# EAGLE design RobotBoard_withMCPower (EAGLE 6.1)
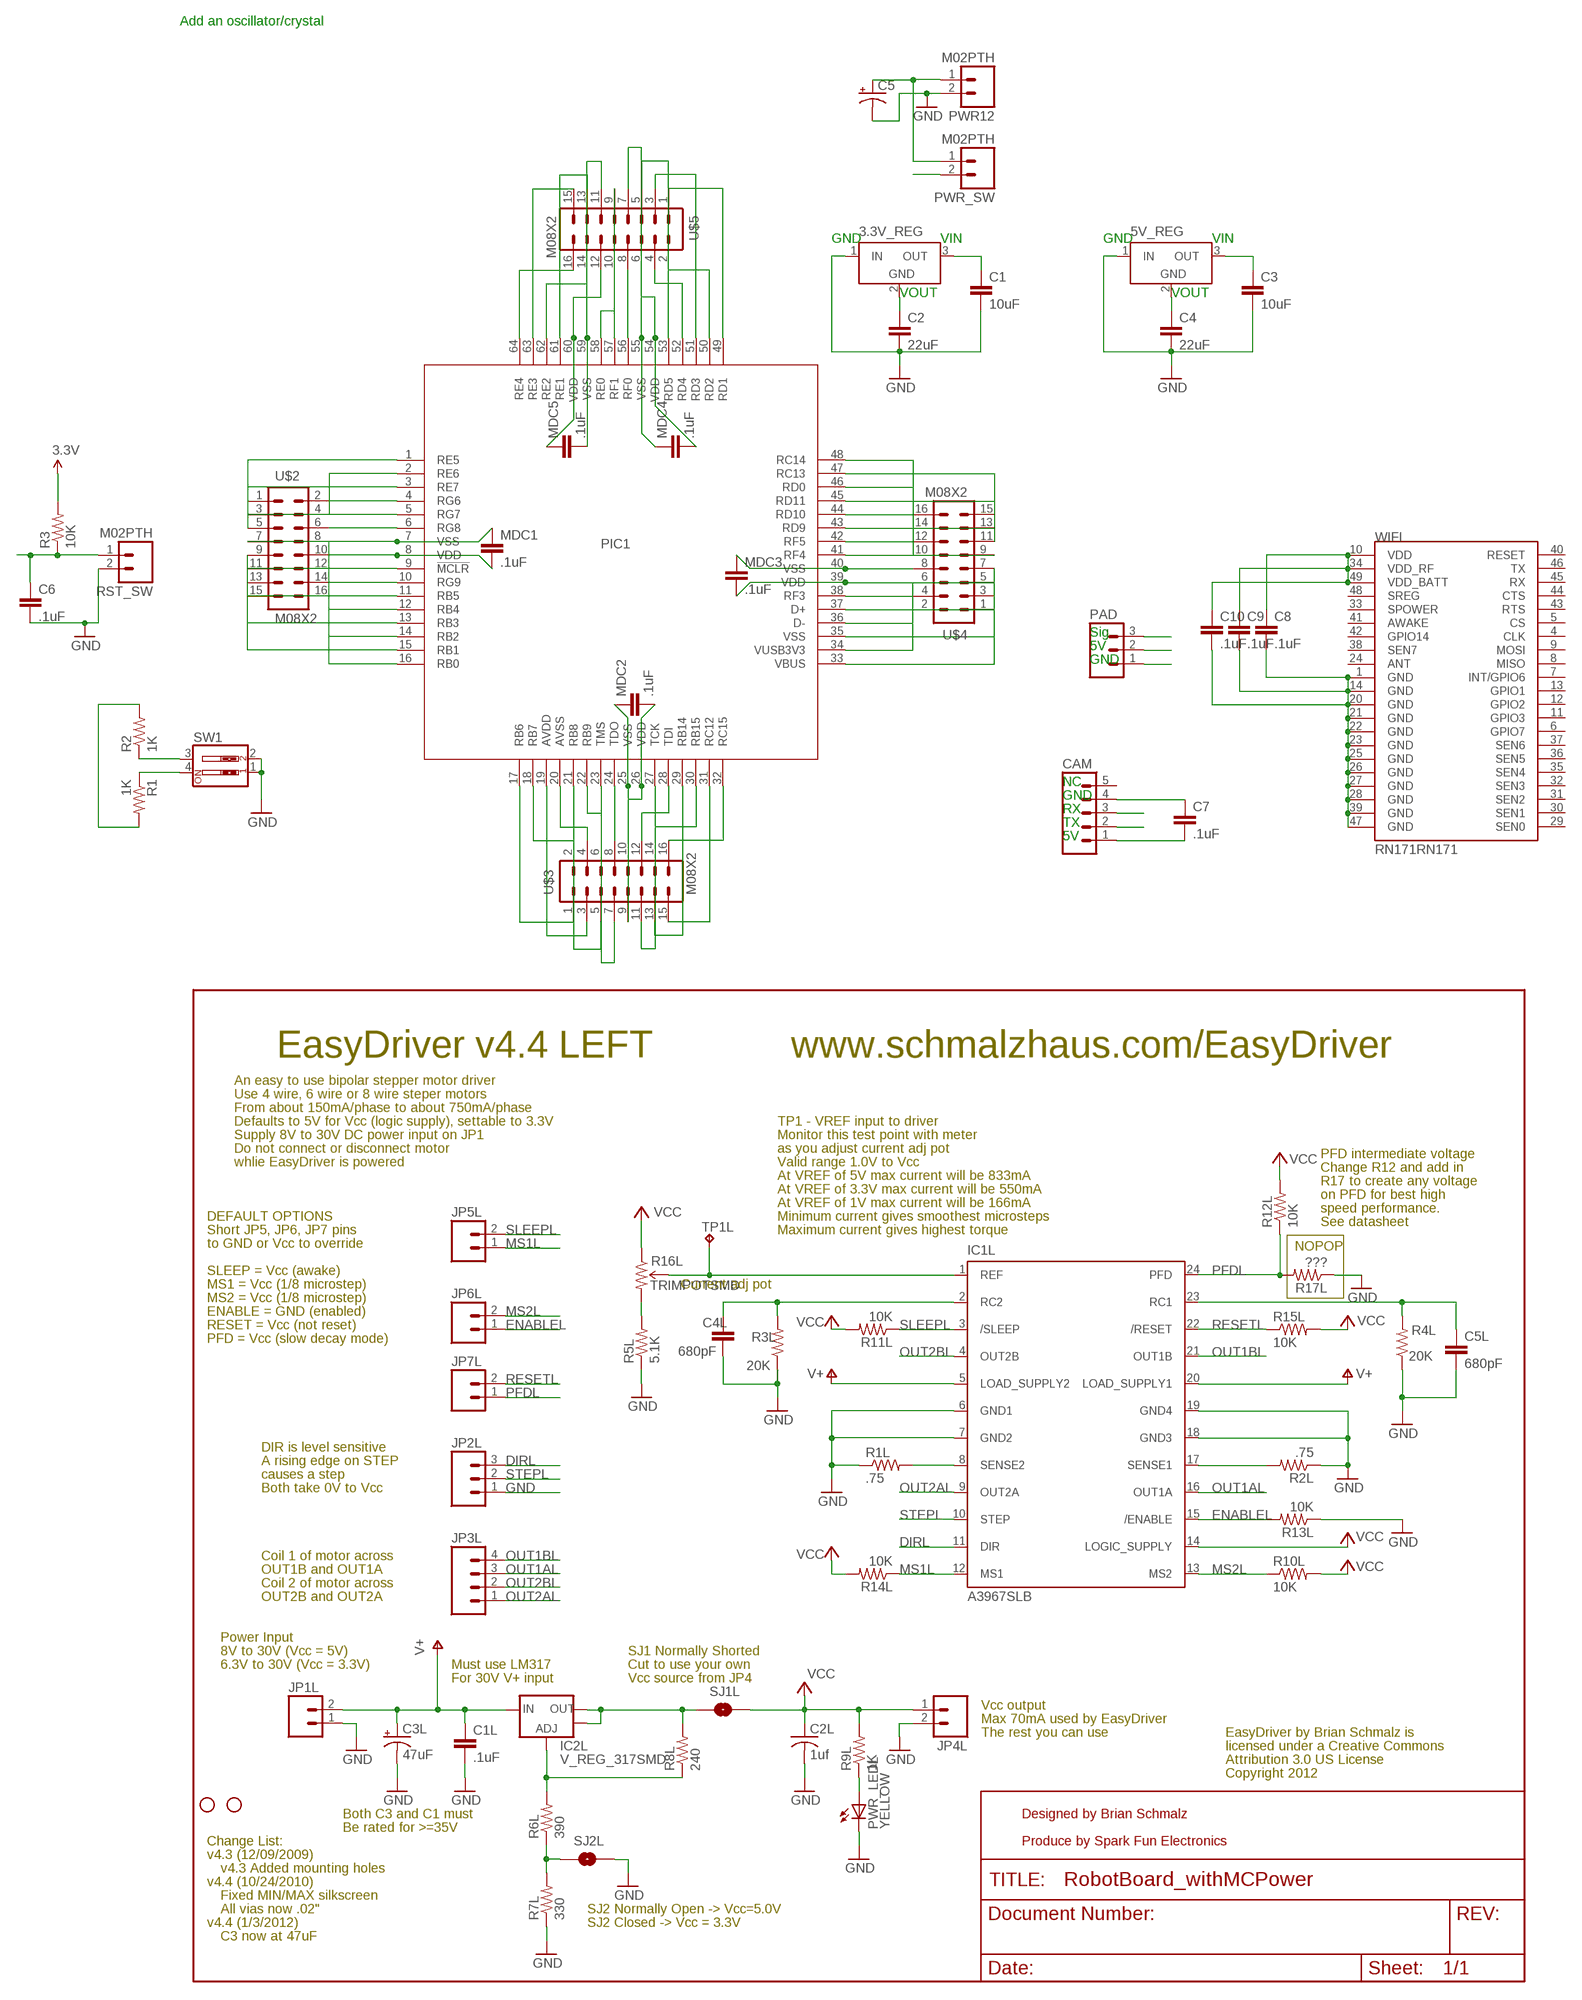
[diagram p0: schematic, sheet 1, part 1 of 2]
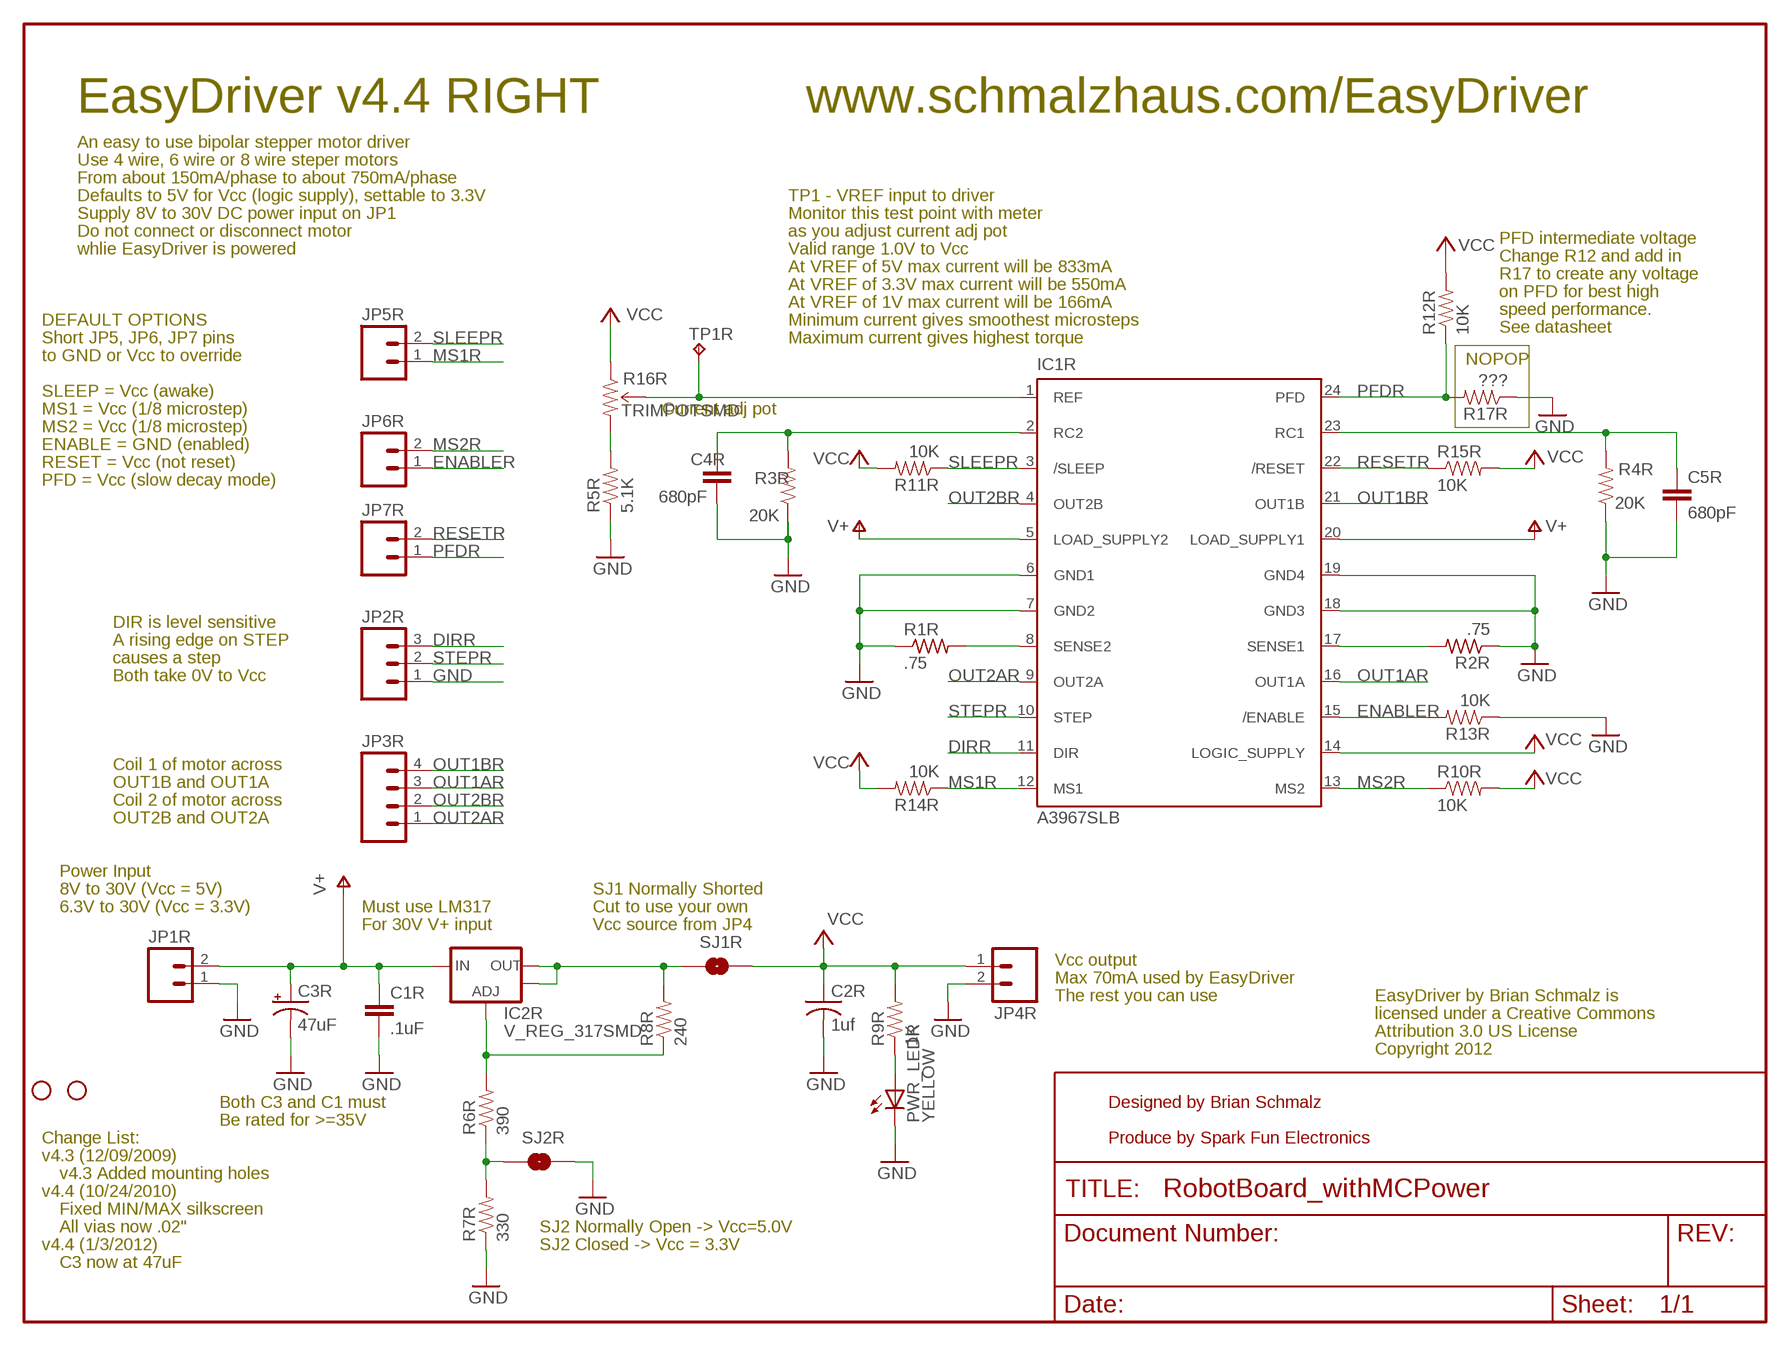
[diagram p1: schematic, sheet 1, part 2 of 2]

## Parts
3.3V_REG  LT1129CST5  [SOT223]
5V_REG  LT1129CST5  [SOT223]
C1  10uF  CAP0603  [0603]
C1L  .1uF  CAP0603  [0603]
C1R  .1uF  CAP0603  [0603]
C2  22uF  CAP0603  [0603]
C2L  1uf  C-USC0603  [C0603]
C2R  1uf  C-USC0603  [C0603]
C3  10uF  CAP0603  [0603]
C3L  47uF  CPOL-USD  [PANASONIC_D]
C3R  47uF  CPOL-USD  [PANASONIC_D]
C4  22uF  CAP0603  [0603]
C4L  680pF  CAP0402  [C0402]
C4R  680pF  CAP0402  [C0402]
C5  CAP_POLPTH4  [CPOL-RADIAL-1000UF-25V]
C5L  680pF  CAP0402  [C0402]
C5R  680pF  CAP0402  [C0402]
C6  .1uF  CAP0603  [0603]
C7  .1uF  CAP0603  [0603]
C8  .1uF  CAP0603  [0603]
C9  .1uF  CAP0603  [0603]
C10  .1uF  CAP0603  [0603]
CAM  M05LOCK  [1X05_LOCK]
IC1L  A3967SLB  [SO24W]
IC1R  A3967SLB  [SO24W]
IC2L  V_REG_317SMD  [SOT223]
IC2R  V_REG_317SMD  [SOT223]
JP1  STAND-OFF  [STAND-OFF]
JP1L  M021X02_NO_SILK  [1X02_NO_SILK]
JP1R  M021X02_NO_SILK  [1X02_NO_SILK]
JP2  STAND-OFF  [STAND-OFF]
JP2L  M031X03_NO_SILK  [1X03_NO_SILK]
JP2R  M031X03_NO_SILK  [1X03_NO_SILK]
JP3L  M041X04_NO_SILK  [1X04_NO_SILK]
JP3R  M041X04_NO_SILK  [1X04_NO_SILK]
JP4L  M021X02_NO_SILK  [1X02_NO_SILK]
JP4R  M021X02_NO_SILK  [1X02_NO_SILK]
JP5L  M021X02_NO_SILK  [1X02_NO_SILK]
JP5R  M021X02_NO_SILK  [1X02_NO_SILK]
JP6L  M021X02_NO_SILK  [1X02_NO_SILK]
JP6R  M021X02_NO_SILK  [1X02_NO_SILK]
JP7L  M021X02_NO_SILK  [1X02_NO_SILK]
JP7R  M021X02_NO_SILK  [1X02_NO_SILK]
JP8  STAND-OFF  [STAND-OFF]
JP9  STAND-OFF  [STAND-OFF]
MDC1  .1uF  CAP0603  [0603]
MDC2  .1uF  CAP0603  [0603]
MDC3  .1uF  CAP0603  [0603]
MDC4  .1uF  CAP0603  [0603]
MDC5  .1uF  CAP0603  [0603]
PAD  M03POLAR  [MOLEX-1X3]
PIC1  PIC32MZ2048ECM064  [TQFP64-10X10X1MM]
PWR12  M02PTH  [1X02]
PWR_LEDL  YELLOW  LED0603  [LED-0603]
PWR_LEDR  YELLOW  LED0603  [LED-0603]
PWR_SW  M02PTH  [1X02]
R1  1K  RESISTOR0402  [C0402]
R1L  .75  R-US_R0805  [R0805]
R1R  .75  R-US_R0805  [R0805]
R2  1K  RESISTOR0402  [C0402]
R2L  .75  R-US_R0805  [R0805]
R2R  .75  R-US_R0805  [R0805]
R3  10K  RESISTOR0402  [C0402]
R3L  20K  RESISTOR0402  [C0402]
R3R  20K  RESISTOR0402  [C0402]
R4L  20K  RESISTOR0402  [C0402]
R4R  20K  RESISTOR0402  [C0402]
R5L  5.1K  RESISTOR0402  [C0402]
R5R  5.1K  RESISTOR0402  [C0402]
R6L  390  RESISTOR0402  [C0402]
R6R  390  RESISTOR0402  [C0402]
R7L  330  RESISTOR0402  [C0402]
R7R  330  RESISTOR0402  [C0402]
R8L  240  RESISTOR0402  [C0402]
R8R  240  RESISTOR0402  [C0402]
R9L  1K  RESISTOR0402  [C0402]
R9R  1K  RESISTOR0402  [C0402]
R10L  10K  RESISTOR0402  [C0402]
R10R  10K  RESISTOR0402  [C0402]
R11L  10K  RESISTOR0402  [C0402]
R11R  10K  RESISTOR0402  [C0402]
R12L  10K  RESISTOR0402  [C0402]
R12R  10K  RESISTOR0402  [C0402]
R13L  10K  RESISTOR0402  [C0402]
R13R  10K  RESISTOR0402  [C0402]
R14L  10K  RESISTOR0402  [C0402]
R14R  10K  RESISTOR0402  [C0402]
R15L  10K  RESISTOR0402  [C0402]
R15R  10K  RESISTOR0402  [C0402]
R16L  TRIMPOTSMD  [TRIMPOT-3MM]
R16R  TRIMPOTSMD  [TRIMPOT-3MM]
R17L  ???  RESISTOR0402  [C0402]
R17R  ???  RESISTOR0402  [C0402]
RST_SW  M02PTH  [1X02]
SJ1L  SOLDERJUMPERTRACE  [SJ_2S-TRACE]
SJ1R  SOLDERJUMPERTRACE  [SJ_2S-TRACE]
SJ2L  SOLDERJUMPERNO  [SJ_2S-NO]
SJ2R  SOLDERJUMPERNO  [SJ_2S-NO]
SW1  SW_DIP-2  [DIPSWITCH-02]
TP1L  TPPAD1-13  [P1-13]
TP1R  TPPAD1-13  [P1-13]
U$2  M08X2  [2X8]
U$3  M08X2  [2X8]
U$4  M08X2  [2X8]
U$5  M08X2  [2X8]
WIFI  RN171RN171  [RN171]

## Nets
5V: 5V_REG.2(GND) C4.1 C7.2 CAM.1 PAD.2 R16L.1(CCW) ; supply symbol labelled VCC
5V_ALT1R: IC2R.2(OUT) IC2R.4(OUT) R8R.2 SJ1R.1
5V_ALTL: IC2L.2(OUT) IC2L.4(OUT) R8L.2 SJ1L.1
!MCLR: C6.1 PIC1.9(!MCLR) R3.1 RST_SW.1 U$2.9
AVDD: PIC1.19(AVDD) U$3.3
AVSS: PIC1.20(AVSS) U$3.4
CAM_RX: CAM.3
CAM_TX: CAM.2
D+: PIC1.37(D+) U$4.5
D-: PIC1.36(D-) U$4.4
DIRL: IC1L.11(DIR) JP2L.3
DIRR: IC1R.11(DIR) JP2R.3
ENABLEL: IC1L.15(/ENABLE) JP6L.1 R13L.2
ENABLER: IC1R.15(/ENABLE) JP6R.1 R13R.2
GND: 3.3V_REG.1(IN) 5V_REG.1(IN) C1.2 C1L.2 C1R.2 C2.2 C2L.2 C2R.2 C3.2 C3L.- C3R.- C4.2 C4L.2 C4R.2 C5.2(-) C5L.2 C5R.2 C6.2 C7.1 C8.2 C9.2 C10.2 CAM.4 IC1L.6(GND1) IC1L.7(GND2) IC1L.18(GND3) IC1L.19(GND4) IC1R.6(GND1) IC1R.7(GND2) IC1R.18(GND3) IC1R.19(GND4) JP1L.1 JP1R.1 JP2L.1 JP2R.1 JP4L.2 JP4R.2 MDC1.1 MDC2.1 MDC3.1 MDC4.1 MDC5.2 PAD.1 PIC1.7(VSS) PIC1.25(VSS) PIC1.35(VSS) PIC1.40(VSS) PIC1.55(VSS) PIC1.59(VSS) PWR12.2 PWR_LEDL.C PWR_LEDR.C R1L.1 R1R.1 R2L.1 R2R.1 R3L.1 R3R.1 R4L.1 R4R.1 R5L.1 R5R.1 R7L.1 R7R.1 R13L.1 R13R.1 R17L.1 R17R.1 RST_SW.2 SJ2L.2 SJ2R.2 SW1.1 SW1.2 U$2.7 U$3.9 U$4.3 U$4.8 U$5.7 U$5.11 WIFI.1(GND) WIFI.14(GND) WIFI.20(GND) WIFI.21(GND) WIFI.22(GND) WIFI.23(GND) WIFI.25(GND) WIFI.26(GND) WIFI.27(GND) WIFI.28(GND) WIFI.39(GND) WIFI.47(GND)
MS1L: IC1L.12(MS1) JP5L.1 R14L.1
MS1R: IC1R.12(MS1) JP5R.1 R14R.1
MS2L: IC1L.13(MS2) JP6L.2 R10L.1
MS2R: IC1R.13(MS2) JP6R.2 R10R.1
N$1: IC1L.8(SENSE2) R1L.2
N$2: PWR_LEDL.A R9L.1
N$3: IC1L.17(SENSE1) R2L.2
N$4: R6L.1 R7L.2 SJ2L.1
N$5: C4L.1 IC1L.2(RC2) R3L.2
N$6: IC2L.1(ADJ) R6L.2 R8L.1
N$7: C5L.1 IC1L.23(RC1) R4L.2
N$8: IC1R.8(SENSE2) R1R.2
N$9: IC1R.17(SENSE1) R2R.2
N$10: C4R.1 IC1R.2(RC2) R3R.2
N$11: R5L.2 R16L.3(CW)
N$12: IC1L.1(REF) R16L.2(WIPER) TP1L.1(TP)
N$13: C5R.1 IC1R.23(RC1) R4R.2
N$14: IC1R.1(REF) R16R.2(WIPER) TP1R.1(TP)
N$15: IC2R.1(ADJ) R6R.2 R8R.1
N$16: R5R.2 R16R.3(CW)
N$17: PWR_LEDR.A R9R.1
N$18: R6R.1 R7R.2 SJ2R.1
N$19: C5.1(+) PWR12.1 PWR_SW.1
N$20: 3.3V_REG.3(OUT) 5V_REG.3(OUT) C1.1 C3.1 PWR_SW.2
N$28: R1.1 SW1.4
N$29: R2.1 SW1.3
N$32: 3.3V_REG.2(GND) C2.1 C8.1 C9.1 C10.1 MDC1.2 MDC2.2 MDC3.2 MDC4.2 MDC5.1 PIC1.8(VDD) PIC1.26(VDD) PIC1.39(VDD) PIC1.54(VDD) PIC1.60(VDD) R1.2 R2.2 R3.2 U$2.8 U$3.10 U$4.7 U$5.6 U$5.12 WIFI.10(VDD) WIFI.34(VDD_RF) WIFI.49(VDD_BATT) ; supply symbol labelled 3.3V
OUT1AL: IC1L.16(OUT1A) JP3L.3
OUT1AR: IC1R.16(OUT1A) JP3R.3
OUT1BL: IC1L.21(OUT1B) JP3L.4
OUT1BR: IC1R.21(OUT1B) JP3R.4
OUT2AL: IC1L.9(OUT2A) JP3L.1
OUT2AR: IC1R.9(OUT2A) JP3R.1
OUT2BL: IC1L.4(OUT2B) JP3L.2
OUT2BR: IC1R.4(OUT2B) JP3R.2
PAD_SIG: PAD.3
PFDL: IC1L.24(PFD) JP7L.1 R12L.1 R17L.2
PFDR: IC1R.24(PFD) JP7R.1 R12R.1 R17R.2
RB0: PIC1.16(RB0) U$2.16
RB1: PIC1.15(RB1) U$2.15
RB2: PIC1.14(RB2) U$2.14
RB3: PIC1.13(RB3) U$2.13
RB4: PIC1.12(RB4) U$2.12
RB5: PIC1.11(RB5) U$2.11
RB6: PIC1.17(RB6) U$3.1
RB7: PIC1.18(RB7) U$3.2
RB8: PIC1.21(RB8) U$3.5
RB9: PIC1.22(RB9) U$3.6
RB14: PIC1.29(RB14) U$3.13
RB15: PIC1.30(RB15) U$3.14
RC12: PIC1.31(RC12) U$3.15
RC13: PIC1.47(RC13) U$4.15
RC14: PIC1.48(RC14) U$4.16
RC15: PIC1.32(RC15) U$3.16
RD0: PIC1.46(RD0) U$4.14
RD1: PIC1.49(RD1) U$5.1
RD2: PIC1.50(RD2) U$5.2
RD3: PIC1.51(RD3) U$5.3
RD4: PIC1.52(RD4) U$5.4
RD5: PIC1.53(RD5) U$5.5
RD9: PIC1.43(RD9) U$4.11
RD10: PIC1.44(RD10) U$4.12
RD11: PIC1.45(RD11) U$4.13
RE0: PIC1.58(RE0) U$5.10
RE1: PIC1.61(RE1) U$5.13
RE2: PIC1.62(RE2) U$5.14
RE3: PIC1.63(RE3) U$5.15
RE4: PIC1.64(RE4) U$5.16
RE5: PIC1.1(RE5) U$2.1
RE6: PIC1.2(RE6) U$2.2
RE7: PIC1.3(RE7) U$2.3
RESETL: IC1L.22(/RESET) JP7L.2 R15L.1
RESETR: IC1R.22(/RESET) JP7R.2 R15R.1
RF0: PIC1.56(RF0) U$5.8
RF1: PIC1.57(RF1) U$5.9
RF3: PIC1.38(RF3) U$4.6
RF4: PIC1.41(RF4) U$4.9
RF5: PIC1.42(RF5) U$4.10
RG6: PIC1.4(RG6) U$2.4
RG7: PIC1.5(RG7) U$2.5
RG8: PIC1.6(RG8) U$2.6
RG9: PIC1.10(RG9) U$2.10
SLEEPL: IC1L.3(/SLEEP) JP5L.2 R11L.1
SLEEPR: IC1R.3(/SLEEP) JP5R.2 R11R.1
STEPL: IC1L.10(STEP) JP2L.2
STEPR: IC1R.10(STEP) JP2R.2
TCK: PIC1.27(TCK) U$3.11
TDD: PIC1.24(TDO) U$3.8
TDI: PIC1.28(TDI) U$3.12
TMS: PIC1.23(TMS) U$3.7
V+: C1L.1 C1R.1 C3L.+ C3R.+ IC1L.5(LOAD_SUPPLY2) IC1L.20(LOAD_SUPPLY1) IC1R.5(LOAD_SUPPLY2) IC1R.20(LOAD_SUPPLY1) IC2L.3(IN) IC2R.3(IN) JP1L.2 JP1R.2
VBUS: PIC1.33(VBUS) U$4.1
VCC: C2L.1 C2R.1 IC1L.14(LOGIC_SUPPLY) IC1R.14(LOGIC_SUPPLY) JP4L.1 JP4R.1 R9L.2 R9R.2 R10L.2 R10R.2 R11L.2 R11R.2 R12L.2 R12R.2 R14L.2 R14R.2 R15L.2 R15R.2 R16R.1(CCW) SJ1L.2 SJ1R.2
VUSB3V3: PIC1.34(VUSB3V3) U$4.2
Unconnected: CAM.5 WIFI.4(CLK) WIFI.5(CS) WIFI.6(GPIO7) WIFI.7(INT/GPIO6) WIFI.8(MISO) WIFI.9(MOSI) WIFI.11(GPIO3) WIFI.12(GPIO2) WIFI.13(GPIO1) WIFI.24(ANT) WIFI.29(SEN0) WIFI.30(SEN1) WIFI.31(SEN2) WIFI.32(SEN3) WIFI.33(SPOWER) WIFI.35(SEN4) WIFI.36(SEN5) WIFI.37(SEN6) WIFI.38(SEN7) WIFI.40(RESET) WIFI.41(AWAKE) WIFI.42(GPIO14) WIFI.43(RTS) WIFI.44(CTS) WIFI.45(RX) WIFI.46(TX) WIFI.48(SREG)

## Notes on the sheet
- Add an oscillator/crystal
- GND | VIN | GND | VIN
- VOUT | VOUT
- Sig
- 5V
- GND
- NC
- GND
- RX
- TX
- 5V
- EasyDriver v4.4 LEFT | www.schmalzhaus.com/EasyDriver
- An easy to use bipolar stepper motor driver
- Use 4 wire, 6 wire or 8 wire steper motors
- From about 150mA/phase to about 750mA/phase
- Defaults to 5V for Vcc (logic supply), settable to 3.3V | TP1 - VREF input to driver
- Supply 8V to 30V DC power input on JP1 | Monitor this test point with meter
- Do not connect or disconnect motor | as you adjust current adj pot
- PFD intermediate voltage
- whlie EasyDriver is powered | Valid range 1.0V to Vcc
- Change R12 and add in
- At VREF of 5V max current will be 833mA
- R17 to create any voltage
- At VREF of 3.3V max current will be 550mA
- on PFD for best high
- At VREF of 1V max current will be 166mA
- speed performance.
- DEFAULT OPTIONS | Minimum current gives smoothest microsteps
- See datasheet
- Short JP5, JP6, JP7 pins | Maximum current gives highest torque
- to GND or Vcc to override | NOPOP
- SLEEP = Vcc (awake)
- MS1 = Vcc (1/8 microstep) | Current adj pot
- MS2 = Vcc (1/8 microstep)
- ENABLE = GND (enabled)
- RESET = Vcc (not reset)
- PFD = Vcc (slow decay mode)
- DIR is level sensitive
- A rising edge on STEP
- causes a step
- Both take 0V to Vcc
- Coil 1 of motor across
- OUT1B and OUT1A
- Coil 2 of motor across
- OUT2B and OUT2A
- Power Input
- 8V to 30V (Vcc = 5V) | SJ1 Normally Shorted
- 6.3V to 30V (Vcc = 3.3V) | Must use LM317 | Cut to use your own
- For 30V V+ input | Vcc source from JP4
- Vcc output
- Max 70mA used by EasyDriver
- The rest you can use | EasyDriver by Brian Schmalz is
- licensed under a Creative Commons
- Attribution 3.0 US License
- Copyright 2012
- Both C3 and C1 must | Designed by Brian Schmalz
- Be rated for >=35V
- Change List: | Produce by Spark Fun Electronics
- v4.3 (12/09/2009)
- v4.3 Added mounting holes
- v4.4 (10/24/2010)
- Fixed MIN/MAX silkscreen
- All vias now .02" | SJ2 Normally Open -> Vcc=5.0V
- v4.4 (1/3/2012) | SJ2 Closed -> Vcc = 3.3V
- C3 now at 47uF
- EasyDriver v4.4 RIGHT | www.schmalzhaus.com/EasyDriver
- An easy to use bipolar stepper motor driver
- Use 4 wire, 6 wire or 8 wire steper motors
- From about 150mA/phase to about 750mA/phase
- Defaults to 5V for Vcc (logic supply), settable to 3.3V | TP1 - VREF input to driver
- Supply 8V to 30V DC power input on JP1 | Monitor this test point with meter
- Do not connect or disconnect motor | as you adjust current adj pot
- PFD intermediate voltage
- whlie EasyDriver is powered | Valid range 1.0V to Vcc
- Change R12 and add in
- At VREF of 5V max current will be 833mA
- R17 to create any voltage
- At VREF of 3.3V max current will be 550mA
- on PFD for best high
- At VREF of 1V max current will be 166mA
- speed performance.
- DEFAULT OPTIONS | Minimum current gives smoothest microsteps
- See datasheet
- Short JP5, JP6, JP7 pins | Maximum current gives highest torque
- to GND or Vcc to override | NOPOP
- SLEEP = Vcc (awake)
- MS1 = Vcc (1/8 microstep) | Current adj pot
- MS2 = Vcc (1/8 microstep)
- ENABLE = GND (enabled)
- RESET = Vcc (not reset)
- PFD = Vcc (slow decay mode)
- DIR is level sensitive
- A rising edge on STEP
- causes a step
- Both take 0V to Vcc
- Coil 1 of motor across
- OUT1B and OUT1A
- Coil 2 of motor across
- OUT2B and OUT2A
- Power Input
- 8V to 30V (Vcc = 5V) | SJ1 Normally Shorted
- 6.3V to 30V (Vcc = 3.3V) | Must use LM317 | Cut to use your own
- For 30V V+ input | Vcc source from JP4
- Vcc output
- Max 70mA used by EasyDriver
- The rest you can use | EasyDriver by Brian Schmalz is
- licensed under a Creative Commons
- Attribution 3.0 US License
- Copyright 2012
- Both C3 and C1 must | Designed by Brian Schmalz
- Be rated for >=35V
- Change List: | Produce by Spark Fun Electronics
- v4.3 (12/09/2009)
- v4.3 Added mounting holes
- v4.4 (10/24/2010)
- Fixed MIN/MAX silkscreen
- All vias now .02" | SJ2 Normally Open -> Vcc=5.0V
- v4.4 (1/3/2012) | SJ2 Closed -> Vcc = 3.3V
- C3 now at 47uF

## Power pins joined to a net without a drawn wire
GND: 3.3V_REG.4(GND) 5V_REG.4(GND)

## Library data of the parts
3.3V_REG 5V_REG = linear-technology:LT1129CST5: VOLTAGE REGULATOR with shutdown; MPN: LT1129CST-5#PBF; OC_FARNELL: 1663375; OC_NEWARK: 57M2069
C1 C1L C1R C2-C4 C6-C10 MDC1-MDC5 = SparkFun-2-11-09:CAP: Capacitor Standard 0603 ceramic capacitor, and 0.1" leaded capacitor.
C2L C2R = rcl:C-US: CAPACITOR, American symbol
C3L C3R = rcl:CPOL-US: POLARIZED CAPACITOR, American symbol
C4L C4R C5L C5R = SparkFun03_30_09:CAP: Capacitor Standard 0603 ceramic capacitor, and 0.1" leaded capacitor.
C5 = SparkFun-Capacitors:CAP_POL: Capacitor Polarized These are standard SMD and PTH capacitors. Normally 10uF, 47uF, and 100uF in electrolytic and tantalum varieties. Always verify the external diameter of the through hole cap, it varies with capacity, voltage, and manufacturer. The EIA devices should be standard.
CAM = SparkFun-Connectors:M05: Header 5 Standard 5-pin 0.1" header. Use with straight break away headers (SKU : PRT-00116), right angle break away headers (PRT-00553), swiss pins (PRT-00743), machine pins (PRT-00117), and female headers (PRT-00115). Molex polarized connector foot print use with SKU : PRT-08230 with associated crimp pins and housings.
IC1L IC1R = Allegro:A3967SLB: ANALOG DEVICES
IC2L IC2R = SparkFun03_30_09:V_REG_317: Voltage Regulator Standard LM317 adjustable voltage regulator. AOI (Adjust Output Input). Google 'LM317 Calculator' for easy to use app to get the two resistor values needed. 240/720 for 5V output. 240/390 for 3.3V output. Spark Fun Electronics SKU : COM-00527
JP1 JP2 JP8 JP9 = SparkFun-7-28-09:STAND-OFF: Stand Off This is the mechanical footprint for a #4 phillips button head screw. Use the keepout ring to avoid running the screw head into surrounding components. SKU : PRT-00447
JP1L JP1R JP4L JP4R JP5L JP5R JP6L JP6R JP7L JP7R = SparkFun:M02: Header 2 Standard 2-pin 0.1" header. Use with straight break away headers (SKU : PRT-00116), right angle break away headers (PRT-00553), swiss pins (PRT-00743), machine pins (PRT-00117), and female headers (PRT-00115). Molex polarized connector foot print use with SKU : PRT-08233 with associated crimp pins and housings.
JP2L JP2R = SparkFun:M03: Header 3 Standard 3-pin 0.1" header. Use with straight break away headers (SKU : PRT-00116), right angle break away headers (PRT-00553), swiss pins (PRT-00743), machine pins (PRT-00117), and female headers (PRT-00115). Molex polarized connector foot print use with SKU : PRT-08232 with associated crimp pins and housings.
JP3L JP3R = SparkFun:M04: Header 4 Standard 4-pin 0.1" header. Use with straight break away headers (SKU : PRT-00116), right angle break away headers (PRT-00553), swiss pins (PRT-00743), machine pins (PRT-00117), and female headers (PRT-00115). Molex polarized connector foot print use with SKU : PRT-08231 with associated crimp pins and housings.
PAD = SparkFun-Connectors:M03: Header 3 Standard 3-pin 0.1" header. Use with straight break away headers (SKU : PRT-00116), right angle break away headers (PRT-00553), swiss pins (PRT-00743), machine pins (PRT-00117), and female headers (PRT-00115). Molex polarized connector foot print use with SKU : PRT-08232 with associated crimp pins and housings.
PIC1 = microchip:PIC32MZ2048ECM064: PIC32MZ2048ECM064 Microchip microcontroller TQFP64 10x10x1
PWR12 PWR_SW RST_SW = SparkFun-Connectors:M02: Standard 2-pin 0.1" header. Use with - straight break away headers ( PRT-00116) - right angle break away headers (PRT-00553) - swiss pins (PRT-00743) - machine pins (PRT-00117) - female headers (PRT-00115) Molex polarized connector foot print use with: PRT-08233 with associated crimp pins and housings. 2.54_SCREWTERM for use with PRT-10571. 3.5mm Screw Terminal footprints for PRT-08084 5mm Screw Terminal footprints for use with PRT-08433
PWR_LEDL PWR_LEDR = SparkFun03_30_09:LED: LEDs Standard schematic elements and footprints for 5mm, 3mm, 1206, and 0603 sized LEDs. 5mm - Spark Fun Electronics SKU : COM-00529 (and others)
R1-R3 R3L R3R R4L R4R R5L R5R R6L R6R R7L R7R R8L R8R R9L R9R R10L R10R R11L R11R R12L R12R R13L R13R R14L R14R R15L R15R R17L R17R = SparkFun03_30_09:RESISTOR: Resistor Basic schematic elements and footprints for 0603, 1206, and PTH 1/10th watt (small) resistors.
R1L R1R R2L R2R = rcl:R-US_: RESISTOR, American symbol
R16L R16R = SparkFun:TRIMPOT
SJ1L SJ1R SJ2L SJ2R = SparkFun03_30_09:SOLDERJUMPER: Solder Jumper Standard SMD solder jumper. Used to automate production. Two varients : Normally Open and Normally Closed are the same, but have different paste layers. NC will have a large amount of paste and should jumper during reflow.
SW1 = SparkFun-Electromechanical:SW_DIP-2: DIP SWITCH
TP1L TP1R = testpad:TP
U$2-U$5 = SparkFun-Connectors:M08X2: .1" headers, two rows of 8 each
WIFI = SparkFun-RF:RN171: WiFi Module

## Board
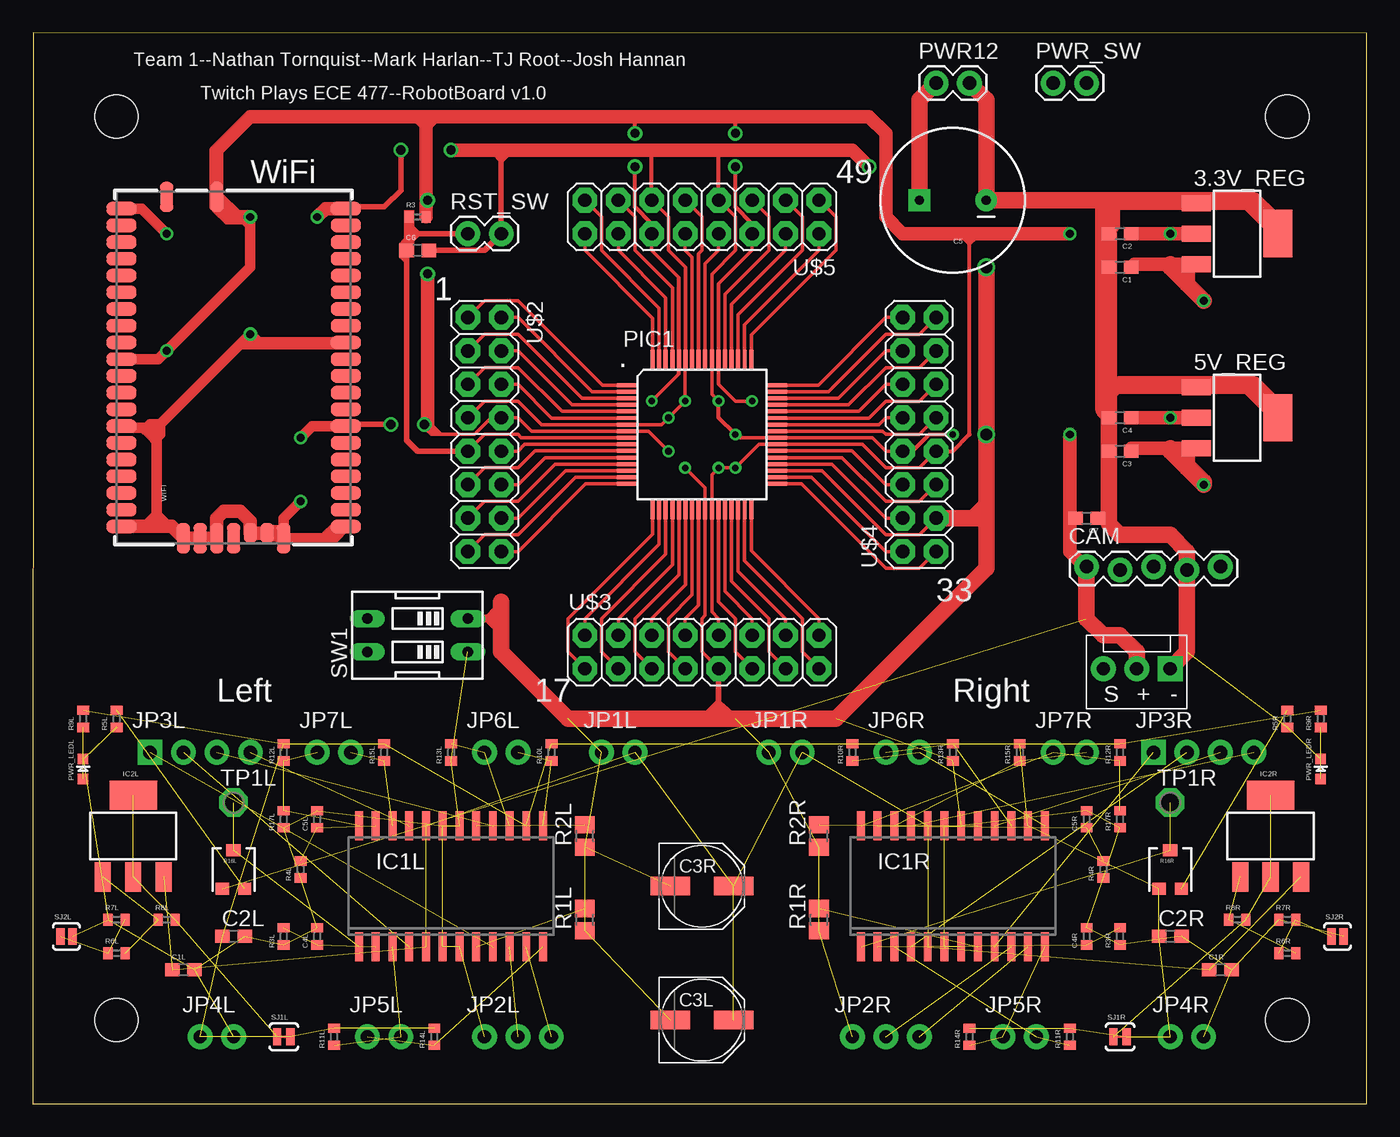
[diagram p2: board, top side]
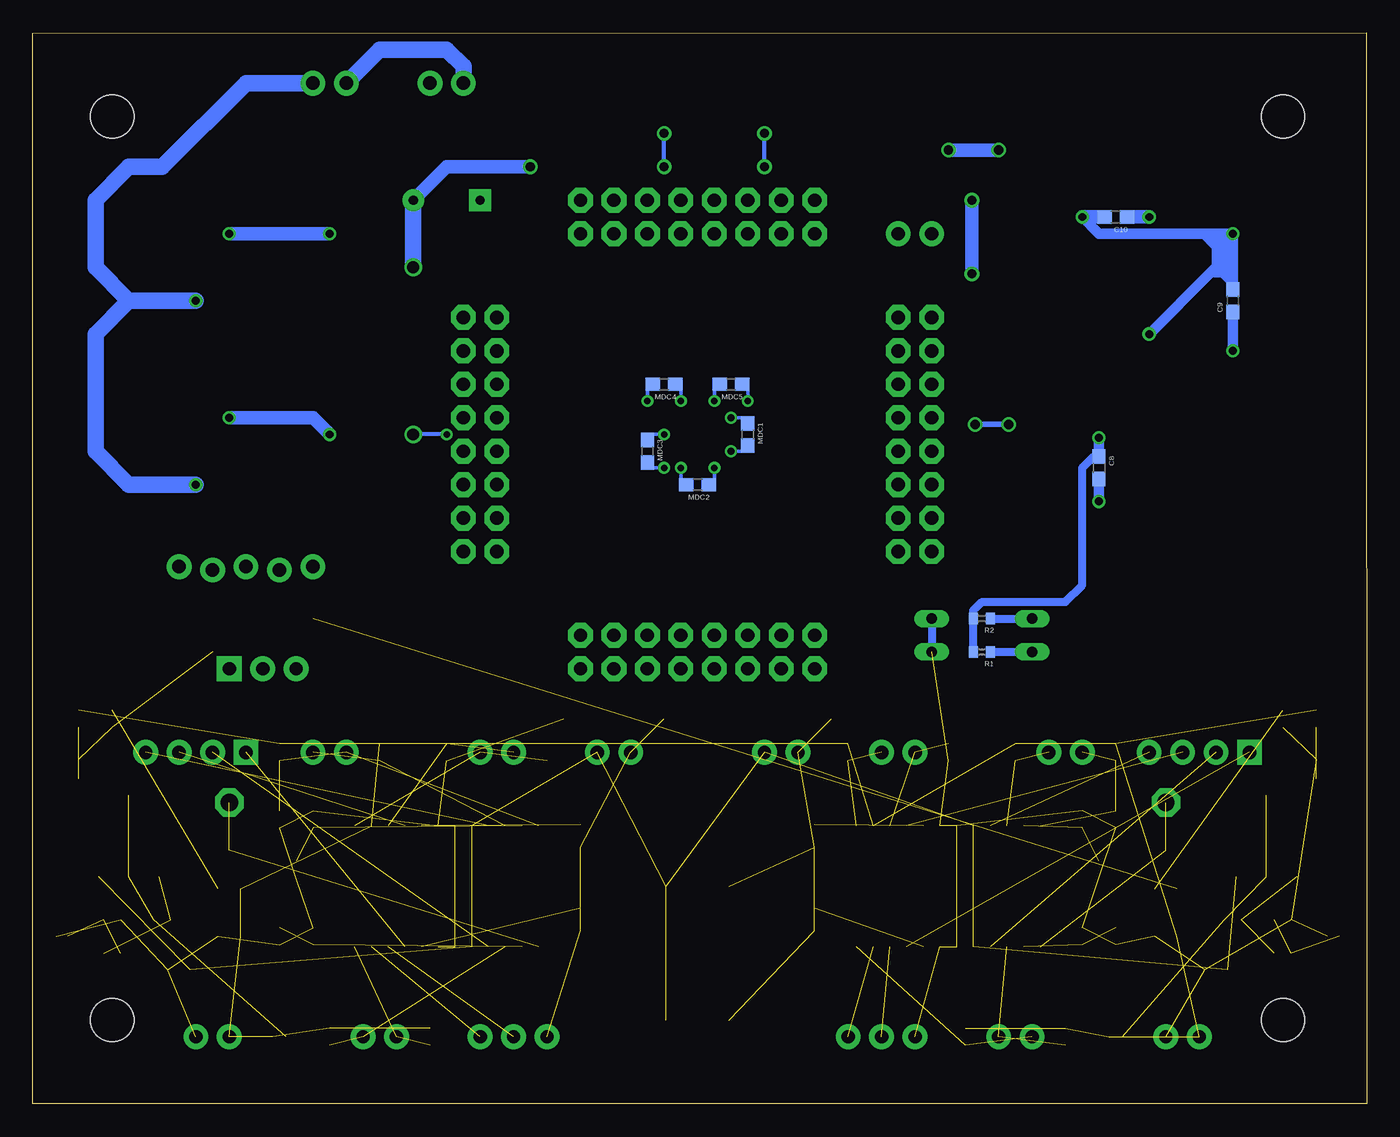
[diagram p3: board, bottom side, seen from below]

Size 101.27 x 81.28 mm. Coordinates in mm from the lower left corner, seen from the top.
Outline: 0,0 101.27,0 101.27,81.27 0.01,81.28 0,0
Copper layers (1*16): Top 0.035mm / dielectric 1.5mm / Bottom 0.035mm
Design rules: minimum track width 10mil, minimum drill 24mil, track to track 8mil, track to pad 8mil, pad to pad 8mil, via to via 8mil, smd to smd 8mil, copper to edge 40mil, drill to drill 8mil, minimum pad ring 10mil, minimum via ring 8mil, stop-mask expansion 4mil, vias tented up to drill 0mil, thermal gap 10mil

### Footprints (pad centres in the part's own frame; a part is rotated, then mirrored left to right if it is on the bottom)
SOT223 = smd 1.219 x 2.235: 1 -2.311,-3.099; 2 0,-3.099; 3 2.311,-3.099 | smd 3.6 x 2.2: 4 0,3.099
0603 = smd 1.1 x 1: 1 -0.85,0; 2 0.85,0
C0603 = smd 1.1 x 1: 1 -0.85,0; 2 0.85,0
PANASONIC_D = smd 3 x 1.4: + 2.4,0; - -2.4,0
C0402 = smd 0.7 x 0.9: 1 -0.65,0; 2 0.65,0
CPOL-RADIAL-1000UF-25V = drill 0.7 pad 1.651 square: 1 2.54,0 | drill 0.7 pad 1.651: 2 -2.54,0
1X05_LOCK = drill 1.016 pad 1.88: 1 0,0.127; 2 2.54,-0.127; 3 5.08,0.127; 4 7.62,-0.127; 5 10.16,0.127
SO24W = smd 0.6 x 2.2: 1 -6.985,-4.6; 2 -5.715,-4.6; 3 -4.445,-4.6; 4 -3.175,-4.6; 5 -1.905,-4.6; 6 -0.635,-4.6; 7 0.635,-4.6; 8 1.905,-4.6; 9 3.175,-4.6; 10 4.445,-4.6; 11 5.715,-4.6; 12 6.985,-4.6; 13 6.985,4.6; 14 5.715,4.6; 15 4.445,4.6; 16 3.175,4.6; 17 1.905,4.6; 18 0.635,4.6; 19 -0.635,4.6; 20 -1.905,4.6; 21 -3.175,4.6; 22 -4.445,4.6; 23 -5.715,4.6; 24 -6.985,4.6
STAND-OFF = hole 3.302: 0,0
1X02_NO_SILK = drill 1.016 pad 1.88: 1 0,0; 2 2.54,0
1X03_NO_SILK = drill 1.016 pad 1.88: 1 0,0; 2 2.54,0; 3 5.08,0
1X04_NO_SILK = drill 1.016 pad 1.88 square: 1 0,0 | drill 1.016 pad 1.88: 2 2.54,0; 3 5.08,0; 4 7.62,0
MOLEX-1X3 = drill 1.016 pad 1.88 square: 1 0,0 | drill 1.016 pad 1.88: 2 2.54,0; 3 5.08,0
TQFP64-10X10X1MM = smd 1.5 x 0.3: 1 -5.7,3.75; 2 -5.7,3.25; 3 -5.7,2.75; 4 -5.7,2.25; 5 -5.7,1.75; 6 -5.7,1.25; 7 -5.7,0.75; 8 -5.7,0.25; 9 -5.7,-0.25; 10 -5.7,-0.75; 11 -5.7,-1.25; 12 -5.7,-1.75; 13 -5.7,-2.25; 14 -5.7,-2.75; 15 -5.7,-3.25; 16 -5.7,-3.75; 33 5.7,-3.75; 34 5.7,-3.25; 35 5.7,-2.75; 36 5.7,-2.25; 37 5.7,-1.75; 38 5.7,-1.25; 39 5.7,-0.75; 40 5.7,-0.25; 41 5.7,0.25; 42 5.7,0.75; 43 5.7,1.25; 44 5.7,1.75; 45 5.7,2.25; 46 5.7,2.75; 47 5.7,3.25; 48 5.7,3.75 | smd 0.3 x 1.5: 17 -3.75,-5.7; 18 -3.25,-5.7; 19 -2.75,-5.7; 20 -2.25,-5.7; 21 -1.75,-5.7; 22 -1.25,-5.7; 23 -0.75,-5.7; 24 -0.25,-5.7; 25 0.25,-5.7; 26 0.75,-5.7; 27 1.25,-5.7; 28 1.75,-5.7; 29 2.25,-5.7; 30 2.75,-5.7; 31 3.25,-5.7; 32 3.75,-5.7; 49 3.75,5.7; 50 3.25,5.7; 51 2.75,5.7; 52 2.25,5.7; 53 1.75,5.7; 54 1.25,5.7; 55 0.75,5.7; 56 0.25,5.7; 57 -0.25,5.7; 58 -0.75,5.7; 59 -1.25,5.7; 60 -1.75,5.7; 61 -2.25,5.7; 62 -2.75,5.7; 63 -3.25,5.7; 64 -3.75,5.7
1X02 = drill 1.016 pad 1.88: 1 0,0; 2 2.54,0
LED-0603 = smd 0.8 x 0.8: A 0,-0.75; C 0,0.75
R0805 = smd 1.3 x 1.5: 1 -0.85,0; 2 0.85,0
TRIMPOT-3MM = smd 1 x 0.9: 1 -0.85,-1.45; 3 0.85,-1.45 | smd 1.1 x 0.9: 2 0,1.45
SJ_2S-TRACE = smd 0.635 x 1.27: 1 -0.508,0; 2 0.508,0
SJ_2S-NO = smd 0.635 x 1.27: 1 -0.45,0; 2 0.45,0
DIPSWITCH-02 = drill 0.813 long: 1 -1.27,-3.81; 2 1.27,-3.81; 3 1.27,3.81; 4 -1.27,3.81
P1-13 = drill 1.321 pad 2.159 octagon: 1 0,0
2X8 = drill 1.016 pad 1.88 octagon: 1 0,0; 2 0,2.54; 3 2.54,0; 4 2.54,2.54; 5 5.08,0; 6 5.08,2.54; 7 7.62,0; 8 7.62,2.54; 9 10.16,0; 10 10.16,2.54; 11 12.7,0; 12 12.7,2.54; 13 15.24,0; 14 15.24,2.54; 15 17.78,0; 16 17.78,2.54
RN171 = smd 1.016 x 2.286: 1 12.065,8.509; 2 10.795,8.509; 3 9.525,8.509; 4 8.255,8.509; 5 6.985,8.509; 6 5.715,8.509; 7 4.445,8.509; 8 3.175,8.509; 9 1.905,8.509; 10 0.635,8.509; 11 -0.635,8.509; 12 -1.905,8.509; 13 -3.175,8.509; 14 -4.445,8.509; 15 -5.715,8.509; 16 -6.985,8.509; 17 -8.255,8.509; 18 -9.525,8.509; 19 -10.795,8.509; 20 -12.065,8.509; 28 -12.065,-8.509; 29 -10.795,-8.509; 30 -9.525,-8.509; 31 -8.255,-8.509; 32 -6.985,-8.509; 33 -5.715,-8.509; 34 -4.445,-8.509; 35 -3.175,-8.509; 36 -1.905,-8.509; 37 -0.635,-8.509; 38 0.635,-8.509; 39 1.905,-8.509; 40 3.175,-8.509; 41 4.445,-8.509; 42 5.715,-8.509; 43 6.985,-8.509; 44 8.255,-8.509; 45 9.525,-8.509; 46 10.795,-8.509; 47 12.065,-8.509 | smd 2.286 x 1.016: 21 -12.954,3.81; 22 -12.954,2.54; 23 -12.954,1.27; 24 -12.954,0; 27 -12.954,-3.81; 48 12.954,5.08; 49 12.954,1.27 | smd 1.524 x 1.016: 25 -12.573,-1.27; 26 -12.573,-2.54

### Placement (x,y rotation side)
3.3V_REG  91.44,66.04 270 top
5V_REG  91.44,52.07 270 top
C1  82.55,63.5 180 top
C1L  11.43,10.16 0 top
C1R  90.17,10.16 0 top
C2  82.55,66.04 180 top
C2L  15.24,12.7 0 top
C2R  86.36,12.7 0 top
C3  82.55,49.53 180 top
C3L  50.8,6.35 0 top
C3R  50.8,16.51 0 top
C4  82.55,52.07 180 top
C4L  21.59,12.7 90 top
C4R  80.01,12.7 90 top
C5  69.85,68.58 180 top
C5L  21.59,21.59 90 top
C5R  80.01,21.59 90 top
C6  29.21,64.77 0 top
C7  80.01,44.45 180 top
C8  20.32,48.26 270 bottom
C9  10.16,60.96 90 bottom
C10  19.05,67.31 180 bottom
CAM  80.01,40.64 0 top
IC1L  31.75,16.51 0 top
IC1R  69.85,16.51 0 top
IC2L  7.62,20.32 0 top
IC2R  93.98,20.32 0 top
JP1  6.35,74.93 0 top
JP1L  43.18,26.67 0 top
JP1R  55.88,26.67 0 top
JP2  95.25,74.93 0 top
JP2L  34.29,5.08 0 top
JP2R  62.23,5.08 0 top
JP3L  8.89,26.67 0 top
JP3R  85.09,26.67 0 top
JP4L  12.7,5.08 0 top
JP4R  86.36,5.08 0 top
JP5L  25.4,5.08 0 top
JP5R  73.66,5.08 0 top
JP6L  34.29,26.67 0 top
JP6R  64.77,26.67 0 top
JP7L  21.59,26.67 0 top
JP7R  77.47,26.67 0 top
JP8  6.35,6.35 0 top
JP9  95.25,6.35 0 top
MDC1  46.99,50.8 270 bottom
MDC2  50.8,46.99 180 bottom
MDC3  54.61,49.53 270 bottom
MDC4  53.34,54.61 180 bottom
MDC5  48.26,54.61 180 bottom
PAD  86.36,33.02 180 top
PIC1  50.8,50.8 0 top
PWR12  68.58,77.47 0 top
PWR_LEDL  3.81,25.4 0 top
PWR_LEDR  97.79,25.4 0 top
PWR_SW  77.47,77.47 0 top
R1  29.21,34.29 180 bottom
R1L  41.91,13.97 90 top
R1R  59.69,13.97 90 top
R2  29.21,36.83 180 bottom
R2L  41.91,20.32 90 top
R2R  59.69,20.32 90 top
R3  29.21,67.31 0 top
R3L  19.05,12.7 90 top
R3R  82.55,12.7 90 top
R4L  20.32,17.78 90 top
R4R  81.28,17.78 90 top
R5L  6.35,29.21 90 top
R5R  95.25,29.21 90 top
R6L  6.35,11.43 0 top
R6R  95.25,11.43 0 top
R7L  6.35,13.97 0 top
R7R  95.25,13.97 0 top
R8L  10.16,13.97 0 top
R8R  91.44,13.97 0 top
R9L  3.81,29.21 90 top
R9R  97.79,29.21 90 top
R10L  39.37,26.67 90 top
R10R  62.23,26.67 90 top
R11L  22.86,5.08 90 top
R11R  78.74,5.08 90 top
R12L  19.05,26.67 90 top
R12R  82.55,26.67 90 top
R13L  31.75,26.67 90 top
R13R  69.85,26.67 90 top
R14L  30.48,5.08 90 top
R14R  71.12,5.08 90 top
R15L  26.67,26.67 90 top
R15R  74.93,26.67 90 top
R16L  15.24,17.78 0 top
R16R  86.36,17.78 0 top
R17L  19.05,21.59 90 top
R17R  82.55,21.59 90 top
RST_SW  33.02,66.04 0 top
SJ1L  19.05,5.08 0 top
SJ1R  82.55,5.08 0 top
SJ2L  2.54,12.7 0 top
SJ2R  99.06,12.7 0 top
SW1  29.21,35.56 90 top
TP1L  15.24,22.86 0 top
TP1R  86.36,22.86 0 top
U$2  33.02,59.69 270 top
U$3  41.91,33.02 0 top
U$4  68.58,41.91 90 top
U$5  59.69,68.58 180 top
WIFI  15.24,55.88 90 top

### Tracks (layer width: path | path; a pad name or v marks a point on that pad's centre or on a via)
5V  (via drill 0.6)  (1 unrouted)
  Top 1.016: 5V_REG.2 v86.36,52.07 C4.1 | CAM.1 79.88,40.77 78.74,41.91 78.74,44.45 | 78.74,44.45 v78.74,50.8 | C7.2 78.74,44.45
  Top 1.27: CAM.1 80.01,36.83 81.28,35.56 82.55,35.56 83.82,34.29 PAD.2
  Bottom 1.016: v78.74,50.8 80.01,52.07 v86.36,52.07
5V_ALT1R  (3 unrouted)
5V_ALTL  (3 unrouted)
!MCLR
  Top 0.254: PIC1.9 37.08,50.55 36.83,50.8 34.29,50.8 U$2.9
  Top 0.406: 28.56,66.04 28.56,64.77 C6.1 28.36,50.38 29.21,49.53 U$2.9 | 28.56,66.04 R3.1 | RST_SW.1 29.21,66.04 | 29.21,66.04 28.56,66.04 | 28.57,66.67 29.21,66.04 | 28.57,65.41 29.21,66.04
AVDD
  Top 0.254: PIC1.19 48.05,41.7 43.18,36.83 43.18,34.29 U$3.3
AVSS
  Top 0.254: PIC1.20 48.55,40.93 44.45,36.83 U$3.4
D+
  Top 0.254: PIC1.37 61.44,49.05 64.77,45.72 67.31,45.72 U$4.5
D-
  Top 0.254: PIC1.36 60.67,48.55 64.77,44.45 U$4.4
DIRL  (1 unrouted)
DIRR  (1 unrouted)
ENABLEL  (2 unrouted)
ENABLER  (2 unrouted)
GND  (via drill 0.5, 0.6, 0.7, 0.9)  (44 unrouted)
  Top 0.254: U$2.7 34.29,53.34 36.83,53.34 38.62,51.55 PIC1.7 47.74,51.55 v48.26,52.07 v49.53,53.34 49.53,55.88 49.55,55.9 PIC1.59 49.55,63.48 48.26,64.77 48.26,67.31 U$5.11 | U$5.7 53.34,67.31 53.34,64.77 51.55,62.98 PIC1.55 51.55,53.86 v52.07,53.34 | U$4.8 64.77,49.53 63.75,50.55 PIC1.40 53.59,50.55 v53.34,50.8 | PIC1.35 59.9,48.05 64.77,43.18 67.31,43.18 U$4.3 | U$3.9 50.8,34.29 50.8,36.83 51.05,37.08 PIC1.25 51.05,46.74 v49.53,48.26
  Top 0.305: U$4.8 66.8,49.53 68.07,50.8 v69.85,50.8 | v53.34,50.8 52.07,52.07 v52.07,53.34 | U$5.11 46.99,72.39 | U$5.7 52.07,72.39
  Top 0.406: C6.2 34.29,64.77 RST_SW.2 35.56,71.63 | 53.34,29.21 52.58,29.97 | 52.58,29.97 52.07,30.48 | 52.07,30.48 U$3.9 | 35.56,71.63 35.56,72.39 | 36.07,72.14 35.56,71.63 | 35.56,71.63 35.05,72.14 | WIFI.47 23.88,68.07 26.67,68.07 27.94,69.34 v27.94,72.39 | 52.07,30.48 51.56,29.97 | 51.56,29.97 50.8,29.21 | 52.07,30.48 52.07,29.46 | 52.07,29.21 52.07,29.46 | 52.07,29.46 52.58,29.97 | 52.58,29.97 51.56,29.97
  Top 0.61: 35.56,36.83 34.54,36.83 | 34.54,36.83 SW1.2 | 35.56,35.81 34.54,36.83 | 34.54,36.83 35.31,37.59 35.81,37.59 35.81,36.83
  Top 0.813: v10.16,66.04 8.26,67.94 WIFI.1 | v20.32,45.72 19.05,44.45 WIFI.27 22.86,42.93 WIFI.28 | WIFI.14 6.86,51.31 8.38,51.31 8.89,50.8 | 8.89,50.8 9.4,50.29 9.4,44.7 | 9.4,44.7 9.4,43.81 | 8.64,43.94 9.4,44.7 | 9.4,44.7 10.16,43.94 | 8.89,50.8 9.65,51.56 | 9.65,51.56 v16.51,58.42 17.14,57.78 WIFI.39 | 9.65,51.56 9.65,50.8 9.4,50.55 | 9.65,51.56 8.89,51.56 8.64,51.31
  Top 1.016: C4.2 81.28,52.49 81.28,52.7 81.28,53.34 82.32,54.38 5V_REG.1 92.23,54.38 5V_REG.4 | C2.2 81.28,66.46 81.28,67.31 82.32,68.35 3.3V_REG.1 88.9,68.35 92.23,68.35 3.3V_REG.4 | C7.1 81.7,44.45 | WIFI.47 22.23,67.94 v21.59,67.31 | WIFI.26 WIFI.25 16.51,44.2 15.75,44.96 14.48,44.96 13.97,44.45 WIFI.23 WIFI.22 WIFI.21 10.54,43.81 9.4,43.81 WIFI.20 | v63.5,71.12 62.23,72.39 52.07,72.39 46.99,72.39 35.56,72.39 v31.75,72.39
  Top 1.27: C2.2 C1.2 C4.2 C3.2 81.7,44.45 81.7,44.03 82.55,43.18 86.36,43.18 87.63,41.91 CAM.4 87.63,34.29 PAD.1 | PWR12.2 72.39,76.2 C5.2 81.28,68.58 | 81.92,68.58 88.67,68.58 | 88.67,68.58 88.9,68.35 | 88.67,68.58 92.71,68.58 93.98,67.31 | 81.92,66.67 81.92,68.58 | 81.92,68.58 81.28,68.58 | 81.28,68.58 81.28,52.7 | WIFI.27 18.67,43.31 WIFI.26 | v72.39,63.5 v72.39,50.8 72.39,45.47 | 72.39,45.47 72.39,44.45 | 72.39,44.45 71.37,44.45 | 71.37,44.45 U$4.3 | 71.37,44.45 72.39,45.47 | 72.39,44.45 72.39,40.64 60.96,29.21 53.34,29.21 52.07,29.21 50.8,29.21 40.64,29.21 35.56,34.29 35.56,35.81 35.56,36.83 35.56,38.1
  Bottom 0.254: MDC1.1 47.41,52.07 v48.26,52.07 | MDC5.2 49.53,54.61 v49.53,53.34 | MDC4.1 52.07,54.61 v52.07,53.34 | MDC3.1 54.61,50.8 v53.34,50.8 | MDC2.1 49.53,46.99 v49.53,48.26
  Bottom 0.305: v69.85,50.8 v72.39,50.8
  Bottom 0.61: SW1.2 SW1.1 | 10.92,64.01 10.92,65.53 11.18,65.53 11.43,65.79 11.43,65.02 | 11.43,65.02 11.43,63.5 10.16,62.23 | 11.43,65.02 12.45,66.04 | 10.67,62.99 11.94,62.99
  Bottom 0.813: C9.2 10.16,62.23 10.16,64.77 | 10.16,64.77 v10.16,66.04 11.43,66.04 | 11.43,66.04 12.45,66.04 20.32,66.04 v21.59,67.31 | 10.16,64.77 10.92,65.53 11.43,66.04 | C8.2 v20.32,45.72 | v16.51,58.42 11.94,62.99 11.43,63.5 10.92,64.01 10.16,64.77
  Bottom 1.016: v21.59,67.31 C10.2 | C5.2 69.85,71.12 v63.5,71.12 | v31.75,72.39 v27.94,72.39
  Bottom 1.27: C5.2 v72.39,63.5
MS1L  (2 unrouted)
MS1R  (2 unrouted)
MS2L  (2 unrouted)
MS2R  (2 unrouted)
N$1  (1 unrouted)
N$2  (1 unrouted)
N$3  (1 unrouted)
N$4  (2 unrouted)
N$5  (2 unrouted)
N$6  (2 unrouted)
N$7  (2 unrouted)
N$8  (1 unrouted)
N$9  (1 unrouted)
N$10  (2 unrouted)
N$11  (1 unrouted)
N$12  (2 unrouted)
N$13  (2 unrouted)
N$14  (2 unrouted)
N$15  (2 unrouted)
N$16  (1 unrouted)
N$17  (1 unrouted)
N$18  (2 unrouted)
N$19
  Top 1.27: C5.1 67.31,76.2 PWR12.1
  Bottom 1.27: PWR12.1 68.58,78.74 69.85,80.01 74.93,80.01 PWR_SW.1
N$20  (via drill 0.6)
  Top 1.016: 5V_REG.3 86.36,49.76 83.4,49.76 C3.1 | 3.3V_REG.3 86.36,63.73 83.63,63.73 C1.1
  Top 1.27: 87.63,49.53 87.63,48.26 v88.9,46.99 | v88.9,60.96 87.63,62.23 | 87.63,62.23 86.36,63.5 86.36,63.73 | 87.63,62.23 87.63,63.5 | v88.9,46.99 88.9,47.22 86.36,49.76 | v88.9,46.99 86.36,49.53
  Bottom 1.27: PWR_SW.2 85.09,77.47 91.44,71.12 93.98,71.12 96.52,68.58 96.52,63.5 93.98,60.96 | v88.9,60.96 93.98,60.96 | 93.98,60.96 96.52,58.42 96.52,49.53 93.98,46.99 v88.9,46.99
N$21
  Top 0.813: 22.86,43.18 22.86,43.69 22.35,43.18
N$22
  Top 1.27: 82.55,54.61 92.71,54.61 93.98,53.34
N$23
  Top 0.254: 28.45,65.53 27.94,65.02
N$24
  Top 0.254: 27.94,64.26 28.19,64.01 28.19,64.26
N$25
  Top 0.254: 27.94,65.28 28.19,65.53
N$26
  Bottom 0.813: 10.41,63.5 10.67,63.75 10.67,63.5 10.41,63.25
N$27
  Top 0.813: 16,57.66 23.88,57.66
N$28
  Bottom 0.61: R1.1 SW1.4
N$29
  Bottom 0.61: R2.1 SW1.3
N$30
  Top 0.61: 13.97,68.33 13.97,67.82 | 13.97,67.82 14.73,67.06 16,67.06 16.26,66.8 | 13.97,67.82 13.72,68.07 13.72,72.39
N$31  (via drill 0.7)
  Top 0.254: 29.97,69.6 v29.97,68.58
  Top 1.016: v29.97,62.99 29.97,51.56
  Bottom 1.016: v29.97,68.58 29.97,66.55 v29.97,62.99
N$32  (via drill 0.5, 0.6, 0.7)
  Top 0.254: 29.97,51.31 30.23,51.31 30.73,50.8 | 37.85,51.05 PIC1.8 46.74,51.05 v48.26,49.53 | 49.02,62.74 49.05,62.71 PIC1.60 49.05,55.4 v46.99,53.34 49.02,55.37 49.02,62.74 | U$5.12 46.99,64.77 49.02,62.74 | U$5.6 54.61,64.77 52.07,62.23 52.07,57.15 52.05,57.13 PIC1.54 52.07,56.48 52.07,54.61 53.34,53.34 v54.61,53.34 | U$4.7 67.31,48.26 64.77,48.26 62.98,50.05 PIC1.39 55.13,50.05 v53.34,48.26 v52.07,48.26 51.55,47.74 PIC1.26 51.55,37.35 52.07,36.83 U$3.10 | 30.99,50.8 33.53,50.8 34.8,52.07 U$2.8 36.83,52.07 37.85,51.05 | 30.99,50.8 30.23,51.56 | 30.73,50.8 30.48,50.8 | 30.48,50.8 30.23,50.8 29.72,51.31 29.97,51.31 | 29.97,51.31 30.48,50.8 | v45.72,73.66 45.72,74.93 29.97,74.93 v29.97,68.58 | v29.97,62.99 29.97,51.56 30.48,51.05 30.48,50.8 | 30.73,50.8 30.99,50.8 | 37.85,51.05 46.74,51.05
  Top 0.305: U$5.6 54.61,66.8 53.34,68.07 v53.34,71.12 | v53.34,73.66 53.34,74.68 | U$5.12 46.99,66.8 45.72,68.07 v45.72,71.12 | 53.85,74.68 53.34,74.68 | 53.34,74.68 52.83,74.68 | 46.23,74.68 45.72,74.68 | 45.72,74.68 45.21,74.68 | U$4.7 69.85,49.53 71.12,50.8 71.12,65.28 | 71.12,66.04 71.12,65.28 | 71.12,65.28 70.61,65.79 71.63,65.79 | 71.88,65.79 71.63,65.79 | 71.63,65.79 71.12,65.28 | v45.72,73.66 45.72,74.68 | 45.72,74.93 45.72,74.68 | 53.34,74.93 53.34,74.68
  Top 0.406: 30.23,51.56 29.97,51.56 v29.72,51.56 | v27.18,51.56 24.38,51.56 24.13,51.31 23.88,51.31 24.13,51.56 23.88,51.56 WIFI.34
  Top 0.813: WIFI.10 9.53,56.52 v10.16,57.15 16.51,63.5 v16.51,67.31 15.24,67.31 13.97,68.58 | v20.32,50.55 21.21,51.44 WIFI.34
  Top 1.016: 3.3V_REG.2 v86.36,66.04 C2.1 | R3.2 29.86,74.31 | 29.86,74.31 30.48,74.93 | 30.48,74.93 45.72,74.93 53.34,74.93 63.5,74.93 64.77,73.66 64.77,67.31 66.04,66.04 71.12,66.04 v78.74,66.04 | v16.51,67.31 15.49,67.31 WIFI.49 | 13.97,68.58 13.97,72.39 16.51,74.93 29.24,74.93 | 29.24,74.93 29.86,74.31 | 29.24,74.93 29.97,74.93 30.48,74.93
  Bottom 0.254: MDC1.2 46.99,49.53 v48.26,49.53 | MDC5.1 46.99,54.61 v46.99,53.34 | MDC4.2 54.61,54.19 v54.61,53.34 | MDC3.2 54.61,48.26 v53.34,48.26 | MDC2.2 52.07,46.99 v52.07,48.26 | v29.97,68.58 v29.97,62.99
  Bottom 0.305: v45.72,71.12 v45.72,73.66 | v53.34,71.12 v53.34,73.66
  Bottom 0.406: v29.72,51.56 v27.18,51.56
  Bottom 0.61: R1.2 R2.2 29.86,37.45 29.21,38.1 22.86,38.1 21.59,39.37 21.59,48.26 20.74,49.11 C8.1
  Bottom 0.813: C9.1 v10.16,57.15 | C8.1 v20.32,50.55
  Bottom 1.016: v78.74,66.04 v86.36,66.04 | C10.1 v16.51,67.31
OUT1AL  (1 unrouted)
OUT1AR  (1 unrouted)
OUT1BL  (1 unrouted)
OUT1BR  (1 unrouted)
OUT2AL  (1 unrouted)
OUT2AR  (1 unrouted)
OUT2BL  (1 unrouted)
OUT2BR  (1 unrouted)
PFDL  (3 unrouted)
PFDR  (3 unrouted)
RB0
  Top 0.254: PIC1.16 41.97,47.05 36.83,41.91 U$2.16
RB1
  Top 0.254: PIC1.15 41.2,47.55 36.83,43.18 34.29,43.18 U$2.15
RB2
  Top 0.254: PIC1.14 40.43,48.05 36.83,44.45 U$2.14
RB3
  Top 0.254: PIC1.13 39.66,48.55 36.83,45.72 34.29,45.72 U$2.13
RB4
  Top 0.254: PIC1.12 38.89,49.05 36.83,46.99 U$2.12
RB5
  Top 0.254: PIC1.11 38.12,49.55 36.83,48.26 34.29,48.26 U$2.11
RB6
  Top 0.254: PIC1.17 47.05,43.24 40.64,36.83 40.64,34.29 U$3.1
RB7
  Top 0.254: PIC1.18 47.55,42.47 41.91,36.83 U$3.2
RB8
  Top 0.254: PIC1.21 49.05,40.16 45.72,36.83 45.72,34.29 U$3.5
RB9
  Top 0.254: PIC1.22 49.55,39.39 46.99,36.83 U$3.6
RB14
  Top 0.254: PIC1.29 53.05,39.66 55.88,36.83 55.88,34.29 U$3.13
RB15
  Top 0.254: PIC1.30 53.55,40.43 57.15,36.83 U$3.14
RC12
  Top 0.254: PIC1.31 54.05,41.2 58.42,36.83 58.42,34.29 U$3.15
RC13
  Top 0.254: PIC1.47 60.4,54.05 64.77,58.42 67.31,58.42 U$4.15
RC14
  Top 0.254: PIC1.48 59.63,54.55 64.77,59.69 U$4.16
RC15
  Top 0.254: PIC1.32 54.55,41.97 59.69,36.83 U$3.16
RD0
  Top 0.254: PIC1.46 61.17,53.55 64.77,57.15 U$4.14
RD1
  Top 0.254: PIC1.49 54.55,58.36 60.96,64.77 60.96,67.31 U$5.1
RD2
  Top 0.254: PIC1.50 54.05,59.13 59.69,64.77 U$5.2
RD3
  Top 0.254: PIC1.51 53.55,59.9 58.42,64.77 58.42,67.31 U$5.3
RD4
  Top 0.254: PIC1.52 53.05,60.67 57.15,64.77 U$5.4
RD5
  Top 0.254: PIC1.53 52.55,61.44 55.88,64.77 55.88,67.31 U$5.5
RD9
  Top 0.254: PIC1.43 63.48,52.05 64.77,53.34 67.31,53.34 U$4.11
RD10
  Top 0.254: PIC1.44 62.71,52.55 64.77,54.61 U$4.12
RD11
  Top 0.254: PIC1.45 61.94,53.05 64.77,55.88 67.31,55.88 U$4.13
RE0
  Top 0.254: PIC1.58 50.05,64.25 49.53,64.77 U$5.10
RE1
  Top 0.254: PIC1.61 48.55,61.94 45.72,64.77 45.72,67.31 U$5.13
RE2
  Top 0.254: PIC1.62 48.05,61.17 44.45,64.77 U$5.14
RE3
  Top 0.254: PIC1.63 47.55,60.4 43.18,64.77 43.18,67.31 U$5.15
RE4
  Top 0.254: PIC1.64 47.05,59.63 41.91,64.77 U$5.16
RE5
  Top 0.254: PIC1.1 43.24,54.55 36.83,60.96 34.29,60.96 U$2.1
RE6
  Top 0.254: PIC1.2 42.47,54.05 36.83,59.69 U$2.2
RE7
  Top 0.254: PIC1.3 41.7,53.55 36.83,58.42 34.29,58.42 U$2.3
RESETL  (2 unrouted)
RESETR  (2 unrouted)
RF0
  Top 0.254: PIC1.56 51.05,63.75 52.07,64.77 U$5.8
RF1
  Top 0.254: PIC1.57 50.55,64.52 50.8,64.77 50.8,67.31 U$5.9
RF3
  Top 0.254: PIC1.38 62.21,49.55 64.77,46.99 U$4.6
RF4
  Top 0.254: PIC1.41 64.52,51.05 64.77,50.8 67.31,50.8 U$4.9
RF5
  Top 0.254: PIC1.42 64.25,51.55 64.77,52.07 U$4.10
RG6
  Top 0.254: PIC1.4 40.93,53.05 36.83,57.15 U$2.4
RG7
  Top 0.254: PIC1.5 40.16,52.55 36.83,55.88 34.29,55.88 U$2.5
RG8
  Top 0.254: PIC1.6 39.39,52.05 36.83,54.61 U$2.6
RG9
  Top 0.254: PIC1.10 37.35,50.05 36.83,49.53 U$2.10
SLEEPL  (2 unrouted)
SLEEPR  (2 unrouted)
STEPL  (1 unrouted)
STEPR  (1 unrouted)
TCK
  Top 0.254: PIC1.27 52.05,38.12 53.34,36.83 53.34,34.29 U$3.11
TDD
  Top 0.254: PIC1.24 50.55,37.85 49.53,36.83 U$3.8
TDI
  Top 0.254: PIC1.28 52.55,38.89 54.61,36.83 U$3.12
TMS
  Top 0.254: PIC1.23 50.05,38.62 48.26,36.83 48.26,34.29 U$3.7
V+  (11 unrouted)
VBUS
  Top 0.254: PIC1.33 58.36,47.05 64.77,40.64 67.31,40.64 U$4.1
VCC  (20 unrouted)
VUSB3V3
  Top 0.254: PIC1.34 59.13,47.55 64.77,41.91 U$4.2
(copper drawn outside any net)
  shapes: Top area x2

### Text on the board
_tsilk: Team 1--Nathan Tornquist--Mark Harlan--TJ Root--Josh Hannan | Twitch Plays ECE 477--RobotBoard v1.0 | WiFi | 49 | 1 | . | 33 | Left | 17 | Right | S | + | -